# Altium schematic sheet Sheet1.SCHDOC
size 420 x 297 mm; SheetNumber: 1; SheetTotal: 1; DocumentName: Sheet1.SCHDOC
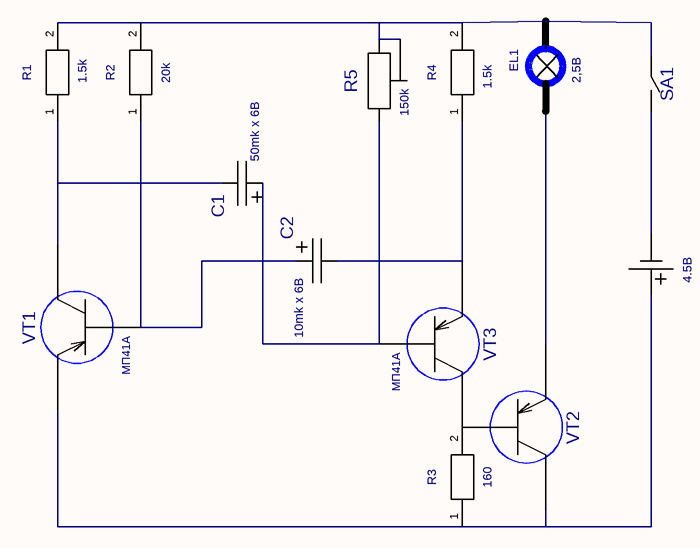
[diagram p0: Sheet1.SCHDOC]

## Parts
C1  value 50mk x 6B  [K5024-6]  (hidden comment: K5024-6)
C2  value 10mk x 6B  [K5024-6]  (hidden comment: K5024-6)
EL1  value 2,5B  [HL_MINI]  (hidden comment: СМН6.3-20-2)
GB1  value 4.5B  [KRONA]  (hidden comment: KRONA)
R1  value 1.5k  [R100]  (hidden comment: R100)
R2  value 20k  [R100]  (hidden comment: R100)
R3  value 160  [R100]  (hidden comment: R100)
R4  value 1.5k  [R100]  (hidden comment: R100)
R5  value 150k  [16K1]  (hidden comment: 16K1)
SA1  8AS9M2RE  [8AS9M2RE]  (value not drawn)
VT1  МП41А  [П27]
VT2  МП41А  [П27]  (value not drawn)
VT3  МП41А  [П27]

## Nets
NetC1_1: C1.1(I/OA) R5.1 VT3.B
NetC1_2: C1.2(I/OB) R1.1 VT1.K
NetC2_1: C2.1(I/OA) R2.1 VT1.B
NetC2_2: C2.2(I/OB) R4.1 VT3.E
NetEL1_1: EL1.1 VT2.E
NetEL1_2: EL1.2 R1.2 R2.2 R4.2 R5.2 R5.3 SA1.2
NetGB1_minus: GB1.minus SA1.1
NetGB1_plus: GB1.plus R3.1 VT1.E VT2.K
NetR3_2: R3.2 VT2.B VT3.K

Not connected (* = marked no-connect by the designer): C1 3 4 5 6; C2 3 4 5 6; GB1 1 2

## Library data of the parts
C1 C2 = K5024-6: PDIF_TY: 11213
GB1 = KRONA: Author: pcbdesigner.ru
SA1 = 8AS9M2RE: Value: *; Author: pcbdesigner.ru
VT1-VT3 = МП41А: Value: *